# Altium project Ignitor 2.0 Apex.PrjPcb
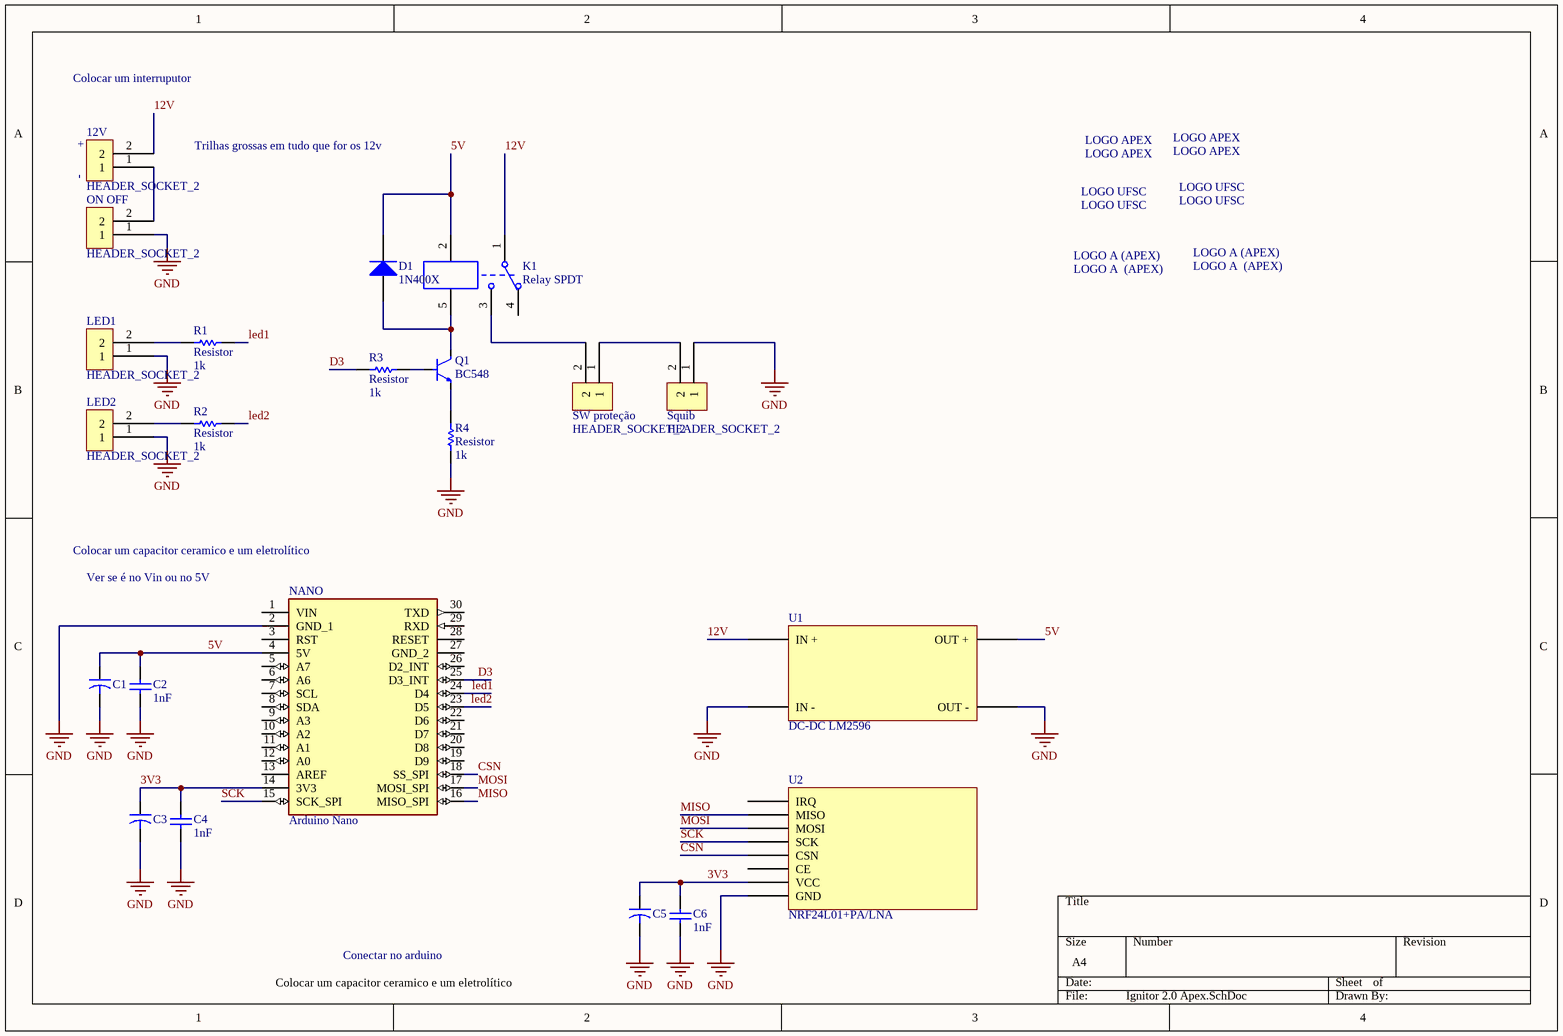
[diagram p0: Ignitor 2.0 Apex.SchDoc]
1 sheet, 28 parts. Net scope: global (net labels, ports and power ports of the same name join across sheets).
Board file: Ignitor 2.0 Apex.PcbDoc

## Sheet Ignitor 2.0 Apex.SchDoc
size A4

### Parts
(Parts that share a designator on the sheet are numbered #1, #2 ... from top to bottom, then left to right.)
12V  HEADER_SOCKET_2  [Pin Header 1x2 TH Pitch 2.54mm]
*#1  LOGO APEX  [Logo Apex]
*#2  LOGO APEX  [Logo Apex]
*#3  LOGO UFSC  [LOGO UFSC]
*#4  LOGO UFSC  [LOGO UFSC]
*#5  LOGO A  (APEX)  [LOGO A (apex)]
*#6  LOGO A  (APEX)  [LOGO A (apex)]
C1  CAP_ELEC  [CAPPR250-63X11]  (value not drawn)
C2  value 1nF  [CAP0805R]  (hidden comment: Cap_ceramic)
C3  CAP_ELEC  [CAPPR250-63X11]  (value not drawn)
C4  value 1nF  [CAP0805R]  (hidden comment: Cap_ceramic)
C5  CAP_ELEC  [CAPPR250-63X11]  (value not drawn)
C6  value 1nF  [CAP0805R]  (hidden comment: Cap_ceramic)
D1  1N400X  [DO-41]
K1  Relay SPDT  [Relay SPDT]
LED1  HEADER_SOCKET_2  [Pin Header 1x2 TH Pitch 2.54mm]
LED2  HEADER_SOCKET_2  [Pin Header 1x2 TH Pitch 2.54mm]
NANO  Arduino Nano  [Arduino nano]
ON_OFF  HEADER_SOCKET_2  [Pin Header 1x2 TH Pitch 2.54mm]
Q1  BC548  [TO-92 - A]
R1  Resistor  value 1k  [RES0805R]
R2  Resistor  value 1k  [RES0805R]
R3  Resistor  value 1k  [RES0805R]
R4  Resistor  value 1k  [RES0805R]
Squib  HEADER_SOCKET_2  [Pin Header 1x2 TH Pitch 2.54mm]
SW_proteção  HEADER_SOCKET_2  [Pin Header 1x2 TH Pitch 2.54mm]
U1  DC-DC LM2596  [DC-DC LM2596]
U2  NRF24L01+PA/LNA  [NRF24L01]

### Nets
GND: C1.2 C2.1 C3.2 C4.1 C5.2 C6.1 LED1.1 LED2.1 NANO.2(GND_1) ON_OFF.1 R4.1 Squib.1 U1.IN_- U1.OUT_- U2.1(GND)
3V3: C3.1 C4.2 C5.1 C6.2 NANO.14(3V3) U2.2(VCC)
5V: C1.1 C2.2 D1.K K1.2 NANO.4(5V) U1.OUT_+
12V: 12V.2 K1.1 U1.IN_+
CSN: NANO.18(SS_SPI) U2.4(CSN)
D3: NANO.25(D3_INT) R3.2
led1: NANO.24(D4) R1.2
led2: NANO.23(D5) R2.2
MISO: NANO.16(MISO_SPI) U2.7(MISO)
MOSI: NANO.17(MOSI_SPI) U2.6(MOSI)
SCK: NANO.15(SCK_SPI) U2.5(SCK)
Net12V_1: 12V.1 ON_OFF.2
NetD1_A: D1.A K1.5 Q1.1(C)
NetK1_3: K1.3 SW_proteção.2
NetLED1_2: LED1.2 R1.1
NetLED2_2: LED2.2 R2.1
NetQ1_2: Q1.2(B) R3.1
NetQ1_3: Q1.3(E) R4.2
NetSquib_2: Squib.2 SW_proteção.1

Not connected (* = marked no-connect by the designer): K1 4; NANO 1(VIN) 3(RST) 5(A7) 6(A6) 7(SCL) 8(SDA) 9(A3) 10(A2) 11(A1) 12(A0) 13(AREF) 19(D9) 20(D8) 21(D7) 22(D6) 26(D2_INT) 27(GND_2) 28(RESET) 29(RXD) 30(TXD); U2 3(CE) 8(IRQ)

### Notes on the sheet
- Colocar um interruputor
- +         -
- Trilhas grossas em tudo que for os 12v
- Colocar um capacitor ceramico e um eletrolítico
- Ver se é no Vin ou no 5V
- Conectar no arduino
- (in symbol LOGO A  (APEX)) LOGO A (APEX)

### Library data of the parts
12V LED1 LED2 ON_OFF Squib SW_proteção = HEADER_SOCKET_2: Socket to header connector with 2 pins
C1 C3 C5 = CAP_ELEC: Capacitor; Published: 23-Sep-2002; PackageReference: CAPR5-4X5; Publisher: Altium Limited; PackageDescription: Capacitor; 2 Leads
C2 C4 C6 = Cap_ceramic: Capacitor; Published: 8-Jun-2000; LatestRevisionDate: 17-Jul-2002; LatestRevisionNote: Re-released for DXP Platform.; PackageReference: RAD-0.3; Publisher: Altium Limited; PackageDescription: Radial Cap, Thru-Hole; 2 Leads; 0.3 in Pin Spacing
D1 = 1N400X: Diode
NANO = Arduino_Nano: Integrated Circuit; Manufacturer_Part_Number: ARDNanoINV; Datasheet Link: https://componentsearchengine.com/Datasheets/2/A000005.pdf; Height: 10.1mm; Manufacturer_Name: Arduino; Mouser Part Number: 992-ARD-NANO30; Mouser Price/Stock: http://www.mouser.com/Search/ProductDetail.aspx?qs=Vxac6xGyzPmCaTfvE003gg%3d%3d
Q1 = BC548: Transistor NPN
R1-R4 = Resistor: Published: 8-Jun-2000; LatestRevisionDate: 17-Jul-2002; LatestRevisionNote: Re-released for DXP Platform.; PackageReference: AXIAL-0.3; Publisher: Altium Limited; PackageDescription: Axial Device, Thru-Hole; 2 Leads; 0.3 in Pin Spacing